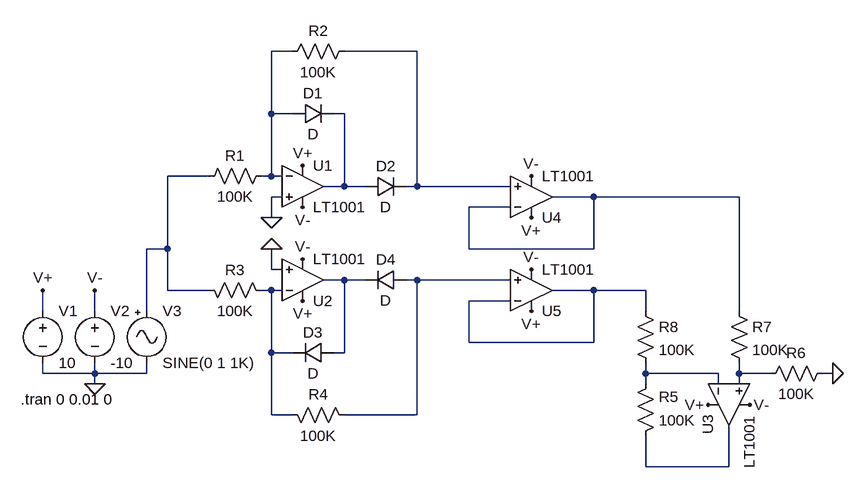
[diagram p0: schematic rectifier.asc]
rectifier.asc, the LTspice schematic file:
Version 4
SHEET 1 1120 680
WIRE 224 -160 192 -160
WIRE 416 -160 304 -160
WIRE 192 -64 192 -160
WIRE 224 -64 192 -64
WIRE 304 -64 288 -64
WIRE 96 32 32 32
WIRE 192 32 192 -64
WIRE 192 32 176 32
WIRE 208 32 192 32
WIRE 304 48 304 -64
WIRE 304 48 272 48
WIRE 336 48 304 48
WIRE 416 48 416 -160
WIRE 416 48 400 48
WIRE 560 48 416 48
WIRE 208 64 192 64
WIRE 688 64 624 64
WIRE 912 64 688 64
WIRE 560 80 496 80
WIRE 192 96 192 64
WIRE 32 144 32 32
WIRE 32 144 0 144
WIRE 496 144 496 80
WIRE 688 144 688 64
WIRE 688 144 496 144
WIRE 192 176 192 144
WIRE 208 176 192 176
WIRE 304 192 272 192
WIRE 336 192 304 192
WIRE 416 192 400 192
WIRE 560 192 416 192
WIRE 32 208 32 144
WIRE 96 208 32 208
WIRE 192 208 176 208
WIRE 208 208 192 208
WIRE 688 208 624 208
WIRE 768 208 688 208
WIRE 560 224 496 224
WIRE -160 240 -160 208
WIRE -80 240 -80 208
WIRE 0 240 0 144
WIRE 768 240 768 208
WIRE 912 240 912 64
WIRE 496 288 496 224
WIRE 688 288 688 208
WIRE 688 288 496 288
WIRE 192 304 192 208
WIRE 224 304 192 304
WIRE 304 304 304 192
WIRE 304 304 288 304
WIRE -160 336 -160 320
WIRE -80 336 -80 320
WIRE -80 336 -160 336
WIRE 0 336 0 320
WIRE 0 336 -80 336
WIRE 768 336 768 320
WIRE 880 336 768 336
WIRE 912 336 912 320
WIRE 960 336 912 336
WIRE 1056 336 1040 336
WIRE -80 352 -80 336
WIRE 768 352 768 336
WIRE 880 352 880 336
WIRE 912 352 912 336
WIRE 192 400 192 304
WIRE 224 400 192 400
WIRE 416 400 416 192
WIRE 416 400 304 400
WIRE 768 480 768 432
WIRE 896 480 896 416
WIRE 896 480 768 480
FLAG 192 96 0
FLAG -80 352 0
FLAG -160 208 V+
FLAG -80 208 V-
FLAG 240 80 V-
FLAG 240 16 V+
FLAG 192 144 0
FLAG 240 160 V-
FLAG 240 224 V+
FLAG 928 384 V-
FLAG 864 384 V+
FLAG 1056 336 0
FLAG 592 32 V-
FLAG 592 96 V+
FLAG 592 176 V-
FLAG 592 240 V+
SYMBOL Opamps\\LT1001 240 -16 R0
SYMATTR InstName U1
SYMBOL res 192 16 R90
WINDOW 0 0 56 VBottom 0
WINDOW 3 32 56 VTop 0
SYMATTR InstName R1
SYMATTR Value 100K
SYMBOL res 208 -144 R270
WINDOW 0 32 56 VTop 0
WINDOW 3 0 56 VBottom 0
SYMATTR InstName R2
SYMATTR Value 100K
SYMBOL diode 224 -48 R270
WINDOW 0 32 32 VTop 0
WINDOW 3 0 32 VBottom 0
SYMATTR InstName D1
SYMBOL diode 336 64 R270
WINDOW 0 32 32 VTop 0
WINDOW 3 0 32 VBottom 0
SYMATTR InstName D2
SYMBOL voltage -160 224 R0
SYMATTR InstName V1
SYMATTR Value 10
SYMBOL voltage -80 224 R0
SYMATTR InstName V2
SYMATTR Value -10
SYMBOL Misc\\signal 0 224 R0
SYMATTR InstName V3
SYMBOL Opamps\\LT1001 240 256 M180
SYMATTR InstName U2
SYMBOL res 192 224 M270
WINDOW 0 32 56 VTop 0
WINDOW 3 0 56 VBottom 0
SYMATTR InstName R3
SYMATTR Value 100K
SYMBOL res 208 384 M90
WINDOW 0 0 56 VBottom 0
WINDOW 3 32 56 VTop 0
SYMATTR InstName R4
SYMATTR Value 100K
SYMBOL diode 288 288 R90
WINDOW 0 0 32 VBottom 0
WINDOW 3 32 32 VTop 0
SYMATTR InstName D3
SYMBOL diode 400 176 R90
WINDOW 0 0 32 VBottom 0
WINDOW 3 32 32 VTop 0
SYMATTR InstName D4
SYMBOL Opamps\\LT1001 832 384 M90
SYMATTR InstName U3
SYMBOL res 752 448 M180
WINDOW 0 36 76 Left 0
WINDOW 3 36 40 Left 0
SYMATTR InstName R5
SYMATTR Value 100K
SYMBOL res 944 352 R270
WINDOW 0 32 56 VTop 0
WINDOW 3 0 56 VBottom 0
SYMATTR InstName R6
SYMATTR Value 100K
SYMBOL res 896 224 R0
SYMATTR InstName R7
SYMATTR Value 100K
SYMBOL res 752 224 R0
SYMATTR InstName R8
SYMATTR Value 100K
SYMBOL Opamps\\LT1001 592 128 M180
SYMATTR InstName U4
SYMBOL Opamps\\LT1001 592 272 M180
SYMATTR InstName U5
TEXT -194 376 Left 0 !.tran 0 0.01 0

The netlist it stands for:
* rectifier.asc
XU1 0 N001 V+ V- N003 LT1001  ; pins In+ In- V+ V- OUT
R1 N001 N004 100K
R2 N001 N002 100K
D1 N001 N003 D
D2 N003 N002 D
V1 V+ 0 10
V2 V- 0 -10
V3 N004 0 SINE(0 1 1K)
XU2 0 N008 V+ V- N006 LT1001  ; pins In+ In- V+ V- OUT
R3 N008 N004 100K
R4 N008 N007 100K
D3 N006 N008 D
D4 N007 N006 D
XU3 N011 N010 V+ V- N012 LT1001  ; pins In+ In- V+ V- OUT
R5 N012 N010 100K
R6 N011 0 100K
R7 N005 N011 100K
R8 N009 N010 100K
XU4 N002 N005 V+ V- N005 LT1001  ; pins In+ In- V+ V- OUT
XU5 N007 N009 V+ V- N009 LT1001  ; pins In+ In- V+ V- OUT
.model D D
.lib standard.dio
.tran 0 0.01 0
.lib LTC.lib
.backanno
.end